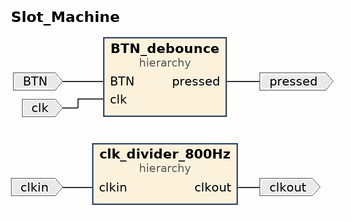
[diagram p0: block diagram of the top level]
# Vivado block design Slot_Machine, xc7a35tcpg236-1, Vivado 2018.3
create_bd_design Slot_Machine

create_bd_port -dir I BTN
create_bd_port -dir I -type clk clk
create_bd_port -dir O -type data pressed
create_bd_port -dir I clkin
create_bd_port -dir O clkout

create_bd_cell -type hier BTN_debounce
create_bd_cell -type hier clk_divider_800Hz

# ---- hierarchy /BTN_debounce ----
current_bd_instance /BTN_debounce
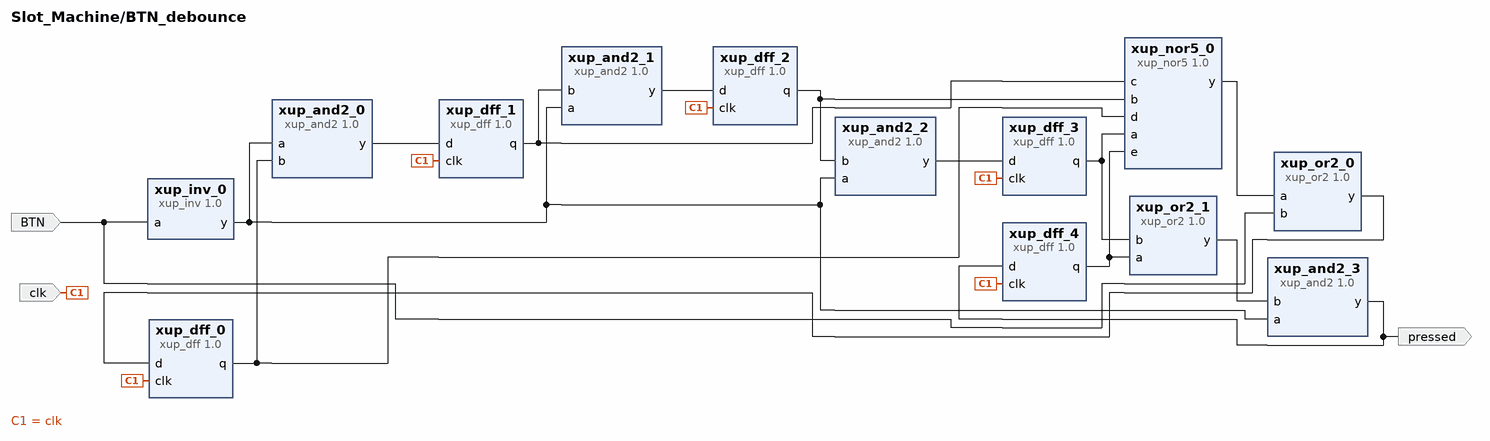
[diagram p1: block diagram inside /BTN_debounce]
create_bd_pin -dir I clk
create_bd_pin -dir O pressed
create_bd_pin -dir I BTN

create_bd_cell -type ip -vlnv xilinx.com:xup:xup_dff:1.0 xup_dff_1
set_property -dict {CONFIG.DELAY 0} [get_bd_cells xup_dff_1]
create_bd_cell -type ip -vlnv xilinx.com:xup:xup_or2:1.0 xup_or2_1
set_property -dict {CONFIG.DELAY 0} [get_bd_cells xup_or2_1]
create_bd_cell -type ip -vlnv xilinx.com:xup:xup_dff:1.0 xup_dff_2
set_property -dict {CONFIG.DELAY 0} [get_bd_cells xup_dff_2]
create_bd_cell -type ip -vlnv xilinx.com:xup:xup_dff:1.0 xup_dff_3
set_property -dict {CONFIG.DELAY 0} [get_bd_cells xup_dff_3]
create_bd_cell -type ip -vlnv xilinx.com:xup:xup_dff:1.0 xup_dff_4
set_property -dict {CONFIG.DELAY 0} [get_bd_cells xup_dff_4]
create_bd_cell -type ip -vlnv xilinx.com:xup:xup_inv:1.0 xup_inv_0
create_bd_cell -type ip -vlnv xilinx.com:xup:xup_and2:1.0 xup_and2_0
set_property -dict {CONFIG.DELAY 0} [get_bd_cells xup_and2_0]
create_bd_cell -type ip -vlnv xilinx.com:xup:xup_and2:1.0 xup_and2_1
set_property -dict {CONFIG.DELAY 0} [get_bd_cells xup_and2_1]
create_bd_cell -type ip -vlnv xilinx.com:xup:xup_nor5:1.0 xup_nor5_0
set_property -dict {CONFIG.DELAY 0} [get_bd_cells xup_nor5_0]
create_bd_cell -type ip -vlnv xilinx.com:xup:xup_and2:1.0 xup_and2_2
set_property -dict {CONFIG.DELAY 0} [get_bd_cells xup_and2_2]
create_bd_cell -type ip -vlnv xilinx.com:xup:xup_dff:1.0 xup_dff_0
set_property -dict {CONFIG.DELAY 0} [get_bd_cells xup_dff_0]
create_bd_cell -type ip -vlnv xilinx.com:xup:xup_or2:1.0 xup_or2_0
set_property -dict {CONFIG.DELAY 0} [get_bd_cells xup_or2_0]
create_bd_cell -type ip -vlnv xilinx.com:xup:xup_and2:1.0 xup_and2_3
set_property -dict {CONFIG.DELAY 0} [get_bd_cells xup_and2_3]

# ---- hierarchy /clk_divider_800Hz ----
current_bd_instance /clk_divider_800Hz
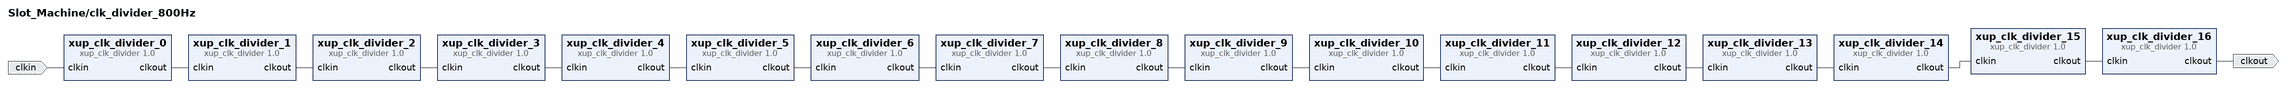
[diagram p2: block diagram inside /clk_divider_800Hz]
create_bd_pin -dir O clkout
create_bd_pin -dir I clkin

create_bd_cell -type ip -vlnv xilinx.com:xup:xup_clk_divider:1.0 xup_clk_divider_2
create_bd_cell -type ip -vlnv xilinx.com:xup:xup_clk_divider:1.0 xup_clk_divider_15
create_bd_cell -type ip -vlnv xilinx.com:xup:xup_clk_divider:1.0 xup_clk_divider_3
create_bd_cell -type ip -vlnv xilinx.com:xup:xup_clk_divider:1.0 xup_clk_divider_16
create_bd_cell -type ip -vlnv xilinx.com:xup:xup_clk_divider:1.0 xup_clk_divider_4
create_bd_cell -type ip -vlnv xilinx.com:xup:xup_clk_divider:1.0 xup_clk_divider_5
create_bd_cell -type ip -vlnv xilinx.com:xup:xup_clk_divider:1.0 xup_clk_divider_6
create_bd_cell -type ip -vlnv xilinx.com:xup:xup_clk_divider:1.0 xup_clk_divider_7
create_bd_cell -type ip -vlnv xilinx.com:xup:xup_clk_divider:1.0 xup_clk_divider_8
create_bd_cell -type ip -vlnv xilinx.com:xup:xup_clk_divider:1.0 xup_clk_divider_9
create_bd_cell -type ip -vlnv xilinx.com:xup:xup_clk_divider:1.0 xup_clk_divider_10
create_bd_cell -type ip -vlnv xilinx.com:xup:xup_clk_divider:1.0 xup_clk_divider_11
create_bd_cell -type ip -vlnv xilinx.com:xup:xup_clk_divider:1.0 xup_clk_divider_12
create_bd_cell -type ip -vlnv xilinx.com:xup:xup_clk_divider:1.0 xup_clk_divider_0
create_bd_cell -type ip -vlnv xilinx.com:xup:xup_clk_divider:1.0 xup_clk_divider_13
create_bd_cell -type ip -vlnv xilinx.com:xup:xup_clk_divider:1.0 xup_clk_divider_1
create_bd_cell -type ip -vlnv xilinx.com:xup:xup_clk_divider:1.0 xup_clk_divider_14

# ---- connections ----

current_bd_instance /BTN_debounce
connect_bd_net [get_bd_pins xup_and2_0/y] [get_bd_pins xup_dff_1/d]
connect_bd_net [get_bd_pins xup_dff_1/q] [get_bd_pins xup_and2_1/b] [get_bd_pins xup_nor5_0/c]
connect_bd_net [get_bd_pins xup_dff_4/q] [get_bd_pins xup_or2_1/a] [get_bd_pins xup_nor5_0/e]
connect_bd_net [get_bd_pins xup_dff_3/q] [get_bd_pins xup_or2_1/b] [get_bd_pins xup_nor5_0/a]
connect_bd_net [get_bd_pins xup_or2_1/y] [get_bd_pins xup_and2_3/b]
connect_bd_net [get_bd_pins xup_and2_1/y] [get_bd_pins xup_dff_2/d]
connect_bd_net [get_bd_pins xup_dff_2/q] [get_bd_pins xup_and2_2/b] [get_bd_pins xup_nor5_0/b]
connect_bd_net [get_bd_pins xup_and2_2/y] [get_bd_pins xup_dff_3/d]
connect_bd_net [get_bd_pins xup_inv_0/y] [get_bd_pins xup_and2_0/a] [get_bd_pins xup_and2_2/a] [get_bd_pins xup_and2_1/a] [get_bd_pins xup_and2_3/a]
connect_bd_net [get_bd_pins xup_dff_0/q] [get_bd_pins xup_and2_0/b] [get_bd_pins xup_nor5_0/d]
connect_bd_net [get_bd_pins xup_nor5_0/y] [get_bd_pins xup_or2_0/a]
connect_bd_net [get_bd_pins xup_or2_0/y] [get_bd_pins xup_dff_0/d]
connect_bd_net [get_bd_pins clk] \
  [get_bd_pins xup_dff_2/clk] [get_bd_pins xup_dff_3/clk] [get_bd_pins xup_dff_4/clk] [get_bd_pins xup_dff_0/clk] \
  [get_bd_pins xup_dff_1/clk]
connect_bd_net [get_bd_pins xup_and2_3/y] [get_bd_pins pressed] [get_bd_pins xup_dff_4/d]
connect_bd_net [get_bd_pins BTN] [get_bd_pins xup_or2_0/b] [get_bd_pins xup_inv_0/a]

current_bd_instance /clk_divider_800Hz
connect_bd_net [get_bd_pins xup_clk_divider_1/clkout] [get_bd_pins xup_clk_divider_2/clkin]
connect_bd_net [get_bd_pins xup_clk_divider_2/clkout] [get_bd_pins xup_clk_divider_3/clkin]
connect_bd_net [get_bd_pins xup_clk_divider_14/clkout] [get_bd_pins xup_clk_divider_15/clkin]
connect_bd_net [get_bd_pins xup_clk_divider_15/clkout] [get_bd_pins xup_clk_divider_16/clkin]
connect_bd_net [get_bd_pins xup_clk_divider_3/clkout] [get_bd_pins xup_clk_divider_4/clkin]
connect_bd_net [get_bd_pins xup_clk_divider_4/clkout] [get_bd_pins xup_clk_divider_5/clkin]
connect_bd_net [get_bd_pins xup_clk_divider_5/clkout] [get_bd_pins xup_clk_divider_6/clkin]
connect_bd_net [get_bd_pins xup_clk_divider_6/clkout] [get_bd_pins xup_clk_divider_7/clkin]
connect_bd_net [get_bd_pins xup_clk_divider_7/clkout] [get_bd_pins xup_clk_divider_8/clkin]
connect_bd_net [get_bd_pins xup_clk_divider_8/clkout] [get_bd_pins xup_clk_divider_9/clkin]
connect_bd_net [get_bd_pins xup_clk_divider_9/clkout] [get_bd_pins xup_clk_divider_10/clkin]
connect_bd_net [get_bd_pins xup_clk_divider_10/clkout] [get_bd_pins xup_clk_divider_11/clkin]
connect_bd_net [get_bd_pins xup_clk_divider_11/clkout] [get_bd_pins xup_clk_divider_12/clkin]
connect_bd_net [get_bd_pins xup_clk_divider_12/clkout] [get_bd_pins xup_clk_divider_13/clkin]
connect_bd_net [get_bd_pins xup_clk_divider_0/clkout] [get_bd_pins xup_clk_divider_1/clkin]
connect_bd_net [get_bd_pins xup_clk_divider_13/clkout] [get_bd_pins xup_clk_divider_14/clkin]
connect_bd_net [get_bd_pins xup_clk_divider_16/clkout] [get_bd_pins clkout]
connect_bd_net -net clkin_0_1 [get_bd_pins clkin] [get_bd_pins xup_clk_divider_0/clkin]

current_bd_instance /
connect_bd_net [get_bd_ports BTN] [get_bd_pins BTN_debounce/BTN]
connect_bd_net [get_bd_ports clk] [get_bd_pins BTN_debounce/clk]
connect_bd_net -net xup_and2_3_y [get_bd_pins BTN_debounce/pressed] [get_bd_ports pressed]
connect_bd_net -net clkin_0_1 [get_bd_ports clkin] [get_bd_pins clk_divider_800Hz/clkin]
connect_bd_net -net xup_clk_divider_16_clkout [get_bd_pins clk_divider_800Hz/clkout] [get_bd_ports clkout]

validate_bd_design
save_bd_design
